# Altium project LCD_PCB_Project.PrjPcb
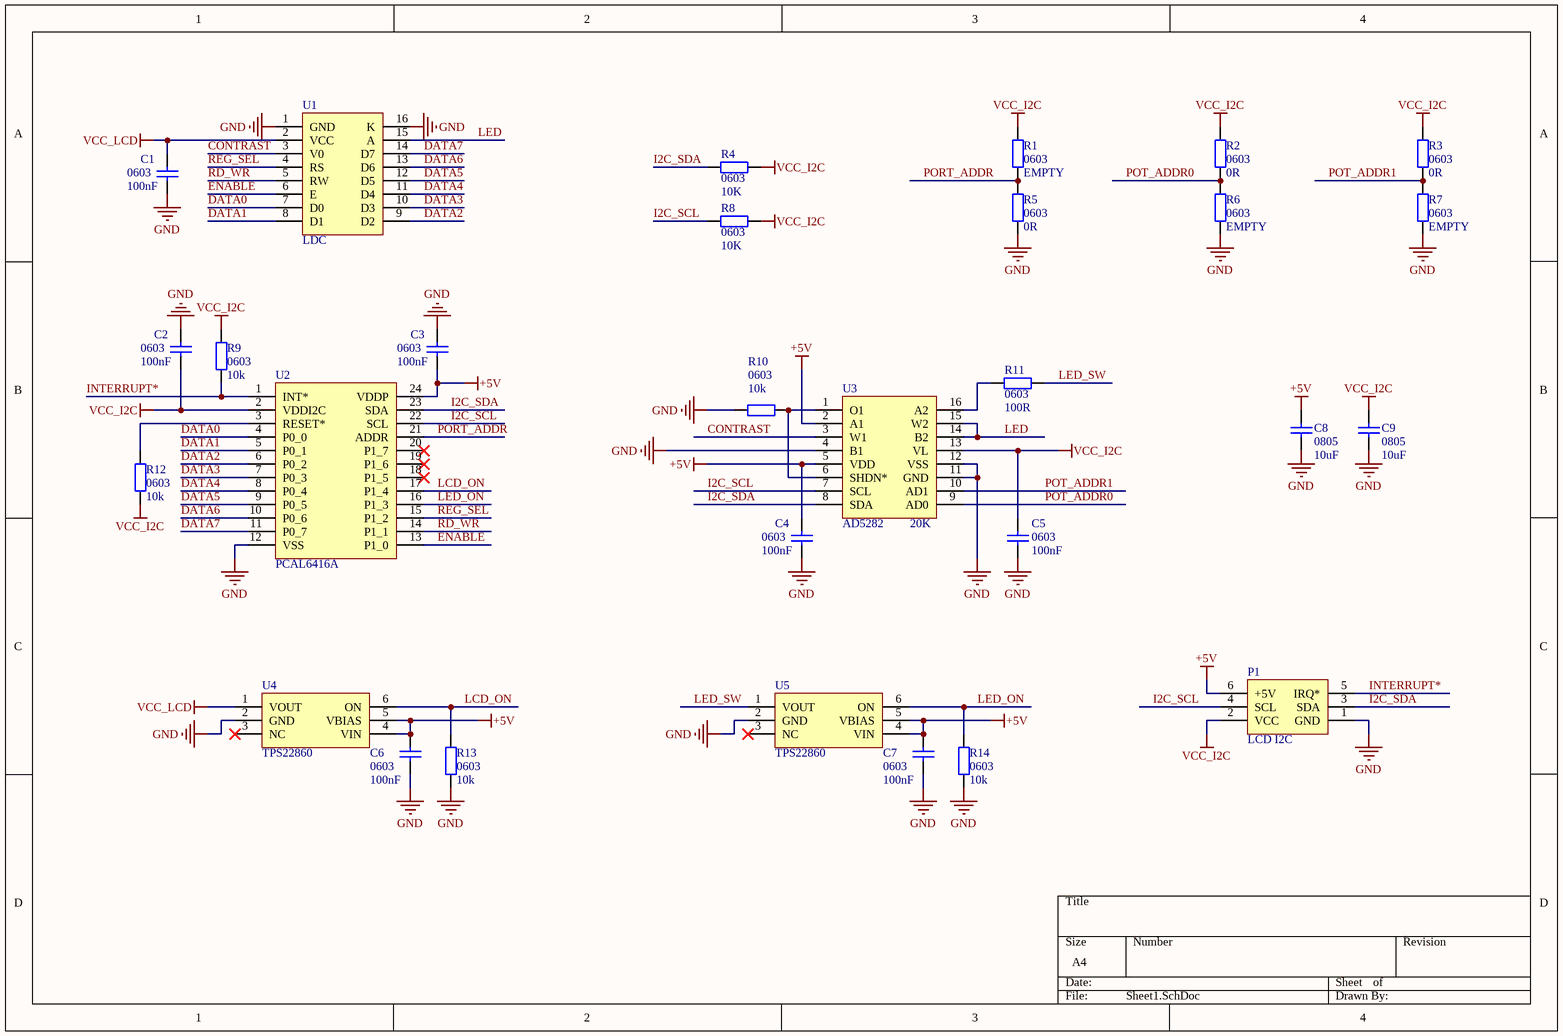
[diagram p0: Sheet1.SchDoc]
1 sheet, 29 parts. Net scope: global (net labels, ports and power ports of the same name join across sheets).
Board file: PCB1.PcbDoc

## Sheet Sheet1.SchDoc
size A4

### Parts
C1  0603  value 100nF  [0603_HandSoldering]
C2  0603  value 100nF  [0603_HandSoldering]
C3  0603  value 100nF  [0603_HandSoldering]
C4  0603  value 100nF  [0603_HandSoldering]
C5  0603  value 100nF  [0603_HandSoldering]
C6  0603  value 100nF  [0603_HandSoldering]
C7  0603  value 100nF  [0603_HandSoldering]
C8  0805  value 10uF  [0805]
C9  0805  value 10uF  [0805]
P1  LCD I2C  [IDC6]
R1  0603  value EMPTY  [0603_HandSoldering]
R2  0603  value 0R  [0603_HandSoldering]
R3  0603  value 0R  [0603_HandSoldering]
R4  0603  value 10K  [0603_HandSoldering]
R5  0603  value 0R  [0603_HandSoldering]
R6  0603  value EMPTY  [0603_HandSoldering]
R7  0603  value EMPTY  [0603_HandSoldering]
R8  0603  value 10K  [0603_HandSoldering]
R9  0603  value 10k  [0603_HandSoldering]
R10  0603  value 10k  [0603_HandSoldering]
R11  0603  value 100R  [0603_HandSoldering]
R12  0603  value 10k  [0603_HandSoldering]
R13  0603  value 10k  [0603_HandSoldering]
R14  0603  value 10k  [0603_HandSoldering]
U1  LDC  [LCD_2x16_Board]
U2  PCAL6416A  [PCAL6416A_TSOP24]
U3  AD5282  value 20K  [AD5282_TSSOP16]
U4  TPS22860  [TPS22860_SOT23_6]
U5  TPS22860  [TPS22860_SOT23_6]

### Nets
+5V: C3.1 C4.2 C6.1 C7.1 C8.2 P1.6(+5V) U2.24(VDDP) U3.2(A1) U3.5(VDD) U4.4(VIN) U4.5(VBIAS) U5.4(VIN) U5.5(VBIAS)
GND: C1.1 C2.2 C3.2 C4.1 C5.2 C6.2 C7.2 C8.1 C9.1 P1.1(GND) R5.1 R6.1 R7.1 R10.1 R13.1 R14.1 U1.1(GND) U1.16(K) U2.12(VSS) U3.4(B1) U3.11(GND) U3.12(VSS) U4.2(GND) U5.2(GND)
VCC_I2C: C2.1 C5.1 C9.2 P1.2(VCC) R1.2 R2.2 R3.2 R4.2 R8.2 R9.1 R12.2 U2.2(VDDI2C) U3.13(VL)
VCC_LCD: C1.2 U1.2(VCC) U4.1(VOUT)
CONTRAST: U1.3(V0) U3.3(W1)
DATA0: U1.7(D0) U2.4(P0_0)
DATA1: U1.8(D1) U2.5(P0_1)
DATA2: U1.9(D2) U2.6(P0_2)
DATA3: U1.10(D3) U2.7(P0_3)
DATA4: U1.11(D4) U2.8(P0_4)
DATA5: U1.12(D5) U2.9(P0_5)
DATA6: U1.13(D6) U2.10(P0_6)
DATA7: U1.14(D7) U2.11(P0_7)
ENABLE: U1.6(E) U2.13(P1_0)
I2C_SCL: P1.4(SCL) R8.1 U2.22(SCL) U3.7(SCL)
I2C_SDA: P1.3(SDA) R4.1 U2.23(SDA) U3.8(SDA)
INTERRUPT*: P1.5(IRQ*) R9.2 U2.1(INT*)
LCD_ON: R13.2 U2.17(P1_4) U4.6(ON)
LED: U1.15(A) U3.14(B2) U3.15(W2)
LED_ON: R14.2 U2.16(P1_3) U5.6(ON)
LED_SW: R11.1 U5.1(VOUT)
PORT_ADDR: R1.1 R5.2 U2.21(ADDR)
POT_ADDR0: R2.1 R6.2 U3.9(AD0)
POT_ADDR1: R3.1 R7.2 U3.10(AD1)
RD_WR: U1.5(RW) U2.14(P1_1)
REG_SEL: U1.4(RS) U2.15(P1_2)
NetR10_2: R10.2 U3.1(O1) U3.6(SHDN*)
NetR11_2: R11.2 U3.16(A2)
NetR12_1: R12.1 U2.3(RESET*)

Not connected (* = marked no-connect by the designer): U2 18(P1_5)* 19(P1_6)* 20(P1_7)*; U4 3(NC)*; U5 3(NC)*

### Library data of the parts
C1-C9 = Capacitor
P1 = LCD_I2C: LCD I2C interface
R1-R14 = Resistor
U1 = LCD_2x16_Board: 2x16 LCD PCB
U2 = PCAL6416A: I2C to parallel converter
U3 = AD5282: Dual digital potentiometer
U4 U5 = TPS22860: Power switch